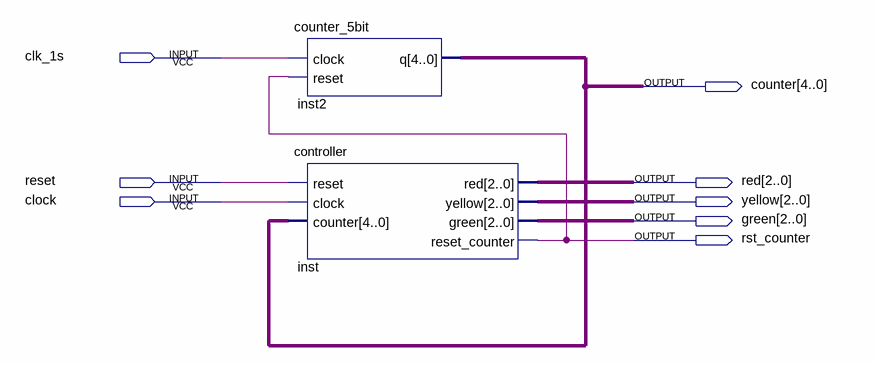
[diagram p0: schematic sheet]
// Quartus schematic system.bdf as structural Verilog: 2 symbols, 8 pins
module system (
  input  clk_1s,
  input  reset,
  input  clock,
  output [4:0] counter,
  output [2:0] red,
  output [2:0] yellow,
  output [2:0] green,
  output rst_counter
);

  counter_5bit inst2 (.clock(clk_1s), .reset(rst_counter), .q(counter));
  controller inst (
    .reset(reset), .clock(clock), .counter(counter), .red(red), .yellow(yellow), .green(green),
    .reset_counter(rst_counter));
endmodule
